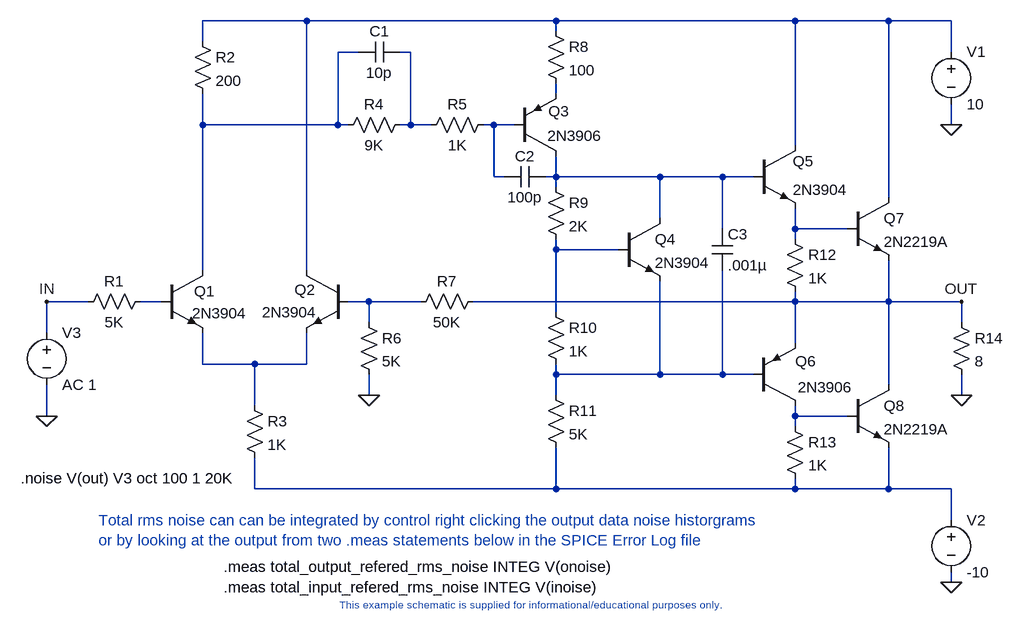
[diagram p0: schematic noise.asc]
noise.asc, the LTspice schematic file:
Version 4
SHEET 1 2344 1928
WIRE 1008 928 848 928
WIRE 1392 928 1008 928
WIRE 1760 928 1392 928
WIRE 1904 928 1760 928
WIRE 2000 928 1904 928
WIRE 1392 944 1392 928
WIRE 848 960 848 928
WIRE 1088 976 1056 976
WIRE 1168 976 1152 976
WIRE 2000 976 2000 928
WIRE 1392 1040 1392 1024
WIRE 848 1088 848 1040
WIRE 1056 1088 1056 976
WIRE 1056 1088 848 1088
WIRE 1072 1088 1056 1088
WIRE 1168 1088 1168 976
WIRE 1168 1088 1152 1088
WIRE 1200 1088 1168 1088
WIRE 1296 1088 1280 1088
WIRE 1328 1088 1296 1088
WIRE 2000 1088 2000 1056
WIRE 1760 1120 1760 928
WIRE 1296 1168 1296 1088
WIRE 1312 1168 1296 1168
WIRE 1392 1168 1392 1136
WIRE 1392 1168 1376 1168
WIRE 1552 1168 1392 1168
WIRE 1648 1168 1552 1168
WIRE 1696 1168 1648 1168
WIRE 1392 1184 1392 1168
WIRE 1904 1200 1904 928
WIRE 1552 1232 1552 1168
WIRE 1648 1248 1648 1168
WIRE 1760 1248 1760 1216
WIRE 1840 1248 1760 1248
WIRE 1760 1264 1760 1248
WIRE 1392 1280 1392 1264
WIRE 1488 1280 1392 1280
WIRE 848 1312 848 1088
WIRE 1008 1312 1008 928
WIRE 672 1360 608 1360
WIRE 784 1360 752 1360
WIRE 1104 1360 1072 1360
WIRE 1184 1360 1104 1360
WIRE 1760 1360 1760 1344
WIRE 1760 1360 1264 1360
WIRE 1904 1360 1904 1296
WIRE 1904 1360 1760 1360
WIRE 2016 1360 1904 1360
WIRE 1392 1376 1392 1280
WIRE 1104 1392 1104 1360
WIRE 2016 1392 2016 1360
WIRE 608 1408 608 1360
WIRE 1760 1424 1760 1360
WIRE 848 1456 848 1408
WIRE 928 1456 848 1456
WIRE 1008 1456 1008 1408
WIRE 1008 1456 928 1456
WIRE 1392 1472 1392 1456
WIRE 1552 1472 1552 1328
WIRE 1552 1472 1392 1472
WIRE 1648 1472 1648 1312
WIRE 1648 1472 1552 1472
WIRE 1696 1472 1648 1472
WIRE 1904 1488 1904 1360
WIRE 1104 1504 1104 1472
WIRE 1392 1504 1392 1472
WIRE 2016 1504 2016 1472
WIRE 928 1520 928 1456
WIRE 608 1536 608 1488
WIRE 1760 1536 1760 1520
WIRE 1840 1536 1760 1536
WIRE 1760 1552 1760 1536
WIRE 928 1648 928 1600
WIRE 1392 1648 1392 1584
WIRE 1392 1648 928 1648
WIRE 1760 1648 1760 1632
WIRE 1760 1648 1392 1648
WIRE 1904 1648 1904 1584
WIRE 1904 1648 1760 1648
WIRE 2000 1648 1904 1648
WIRE 2000 1696 2000 1648
WIRE 2000 1792 2000 1776
FLAG 2000 1088 0
FLAG 2000 1792 0
FLAG 2016 1504 0
FLAG 1104 1504 0
FLAG 608 1536 0
FLAG 608 1360 IN
FLAG 2016 1360 OUT
SYMBOL NPN 1696 1120 R0
WINDOW 0 60 24 Left 2
WINDOW 3 60 68 Left 2
SYMATTR InstName Q5
SYMATTR Value 2N3904
SYMBOL npn 1840 1200 R0
SYMATTR InstName Q7
SYMATTR Value 2N2219A
SYMBOL npn 1840 1488 R0
SYMATTR InstName Q8
SYMATTR Value 2N2219A
SYMBOL PNP 1696 1520 M180
WINDOW 0 64 68 Left 2
WINDOW 3 68 28 Left 2
SYMATTR InstName Q6
SYMATTR Value 2N3906
SYMBOL VOLTAGE 2000 960 R0
SYMATTR InstName V1
SYMATTR Value 10
SYMBOL voltage 2000 1680 R0
SYMATTR InstName V2
SYMATTR Value -10
SYMBOL RES 1376 1488 R0
SYMATTR InstName R11
SYMATTR Value 5K
SYMBOL res 2000 1376 R0
SYMATTR InstName R14
SYMATTR Value 8
SYMBOL res 1376 1168 R0
SYMATTR InstName R9
SYMATTR Value 2K
SYMBOL res 1376 1360 R0
SYMATTR InstName R10
SYMATTR Value 1K
SYMBOL npn 1488 1232 R0
SYMATTR InstName Q4
SYMATTR Value 2N3904
SYMBOL npn 784 1312 R0
WINDOW 0 51 32 Left 2
WINDOW 3 48 66 Left 2
SYMATTR InstName Q1
SYMATTR Value 2N3904
SYMBOL npn 1072 1312 M0
WINDOW 0 50 30 Left 2
WINDOW 3 48 64 Left 2
SYMATTR InstName Q2
SYMATTR Value 2N3904
SYMBOL res 832 944 R0
SYMATTR InstName R2
SYMATTR Value 200
SYMBOL res 912 1504 R0
SYMATTR InstName R3
SYMATTR Value 1K
SYMBOL pnp 1328 1136 M180
WINDOW 0 52 69 Left 2
WINDOW 3 51 31 Left 2
SYMATTR InstName Q3
SYMATTR Value 2N3906
SYMBOL res 1088 1376 R0
SYMATTR InstName R6
SYMATTR Value 5K
SYMBOL res 1280 1344 R90
WINDOW 0 0 56 VBottom 2
WINDOW 3 32 56 VTop 2
SYMATTR InstName R7
SYMATTR Value 50K
SYMBOL voltage 608 1392 R0
SYMATTR InstName V3
SYMATTR Value AC 1
SYMBOL res 768 1344 R90
WINDOW 0 0 56 VBottom 2
WINDOW 3 32 56 VTop 2
SYMATTR InstName R1
SYMATTR Value 5K
SYMBOL res 1376 928 R0
SYMATTR InstName R8
SYMATTR Value 100
SYMBOL res 1168 1072 R90
WINDOW 0 0 56 VBottom 2
WINDOW 3 32 56 VTop 2
SYMATTR InstName R4
SYMATTR Value 9K
SYMBOL cap 1376 1152 R90
WINDOW 0 0 32 VBottom 2
WINDOW 3 32 32 VTop 2
SYMATTR InstName C2
SYMATTR Value 100p
SYMBOL cap 1152 960 R90
WINDOW 0 0 32 VBottom 2
WINDOW 3 32 32 VTop 2
SYMATTR InstName C1
SYMATTR Value 10p
SYMBOL res 1744 1536 R0
SYMATTR InstName R13
SYMATTR Value 1K
SYMBOL res 1744 1248 R0
SYMATTR InstName R12
SYMATTR Value 1K
SYMBOL cap 1632 1248 R0
SYMATTR InstName C3
SYMATTR Value .001µ
SYMBOL res 1296 1072 R90
WINDOW 0 0 56 VBottom 2
WINDOW 3 32 56 VTop 2
SYMATTR InstName R5
SYMATTR Value 1K
TEXT 1344 1816 Top 1 ;This example schematic is supplied for informational/educational purposes only.
TEXT 568 1632 Left 2 !.noise V(out) V3 oct 100 1 20K
TEXT 688 1696 Left 2 ;Total rms noise can can be integrated by control right clicking the output data noise historgrams\nor by looking at the output from two .meas statements below in the SPICE Error Log file
TEXT 880 1768 Left 2 !.meas total_output_refered_rms_noise INTEG V(onoise)\n.meas total_input_refered_rms_noise INTEG V(inoise)

The netlist it stands for:
* noise.asc
Q5 N001 N006 N007 0 2N3904
Q7 N001 N007 OUT 0 2N2219A
Q8 OUT N013 N014 0 2N2219A
Q6 N013 N012 OUT 0 2N3906
V1 N001 0 10
V2 N014 0 -10
R11 N012 N014 5K
R14 OUT 0 8
R9 N006 N008 2K
R10 N008 N012 1K
Q4 N006 N008 N012 0 2N3904
Q1 N002 N009 N011 0 2N3904
Q2 N001 N010 N011 0 2N3904
R2 N001 N002 200
R3 N011 N014 1K
Q3 N006 N005 N004 0 2N3906
R6 N010 0 5K
R7 OUT N010 50K
V3 IN 0 AC 1
R1 N009 IN 5K
R8 N001 N004 100
R4 N003 N002 9K
C2 N006 N005 100p
C1 N003 N002 10p
R13 N013 N014 1K
R12 N007 OUT 1K
C3 N006 N012 .001µ
R5 N005 N003 1K
.model NPN NPN
.model PNP PNP
.lib standard.bjt
* This example schematic is supplied for informational/educational purposes only.
.noise V(out) V3 oct 100 1 20K
* Total rms noise can can be integrated by control right clicking the output data noise historgrams
* or by looking at the output from two .meas statements below in the SPICE Error Log file
.meas total_output_refered_rms_noise INTEG V(onoise)
.meas total_input_refered_rms_noise INTEG V(inoise)
.backanno
.end